# EasyEDA Pro project ProPrj_恒流源_2026-07-14.epro, schematic Schematic1
Assembly Variant: Basic; Board Name: Board1; Create Date: 2026-04-07; Page Name: P1; Project Name: 恒流源; Schematic Name: Schematic1; Simulation Name: P1; Update Date: 2026-04-07; BladeWidth: 10; Company: 嘉立创EDA; Page Size: A4; RegionStart: 1; ShowBorder: 1; TitleBlock: 1; TitleBlockPosition: 3; Version: V1.0; XRegionCount: 6; YRegionCount: 4
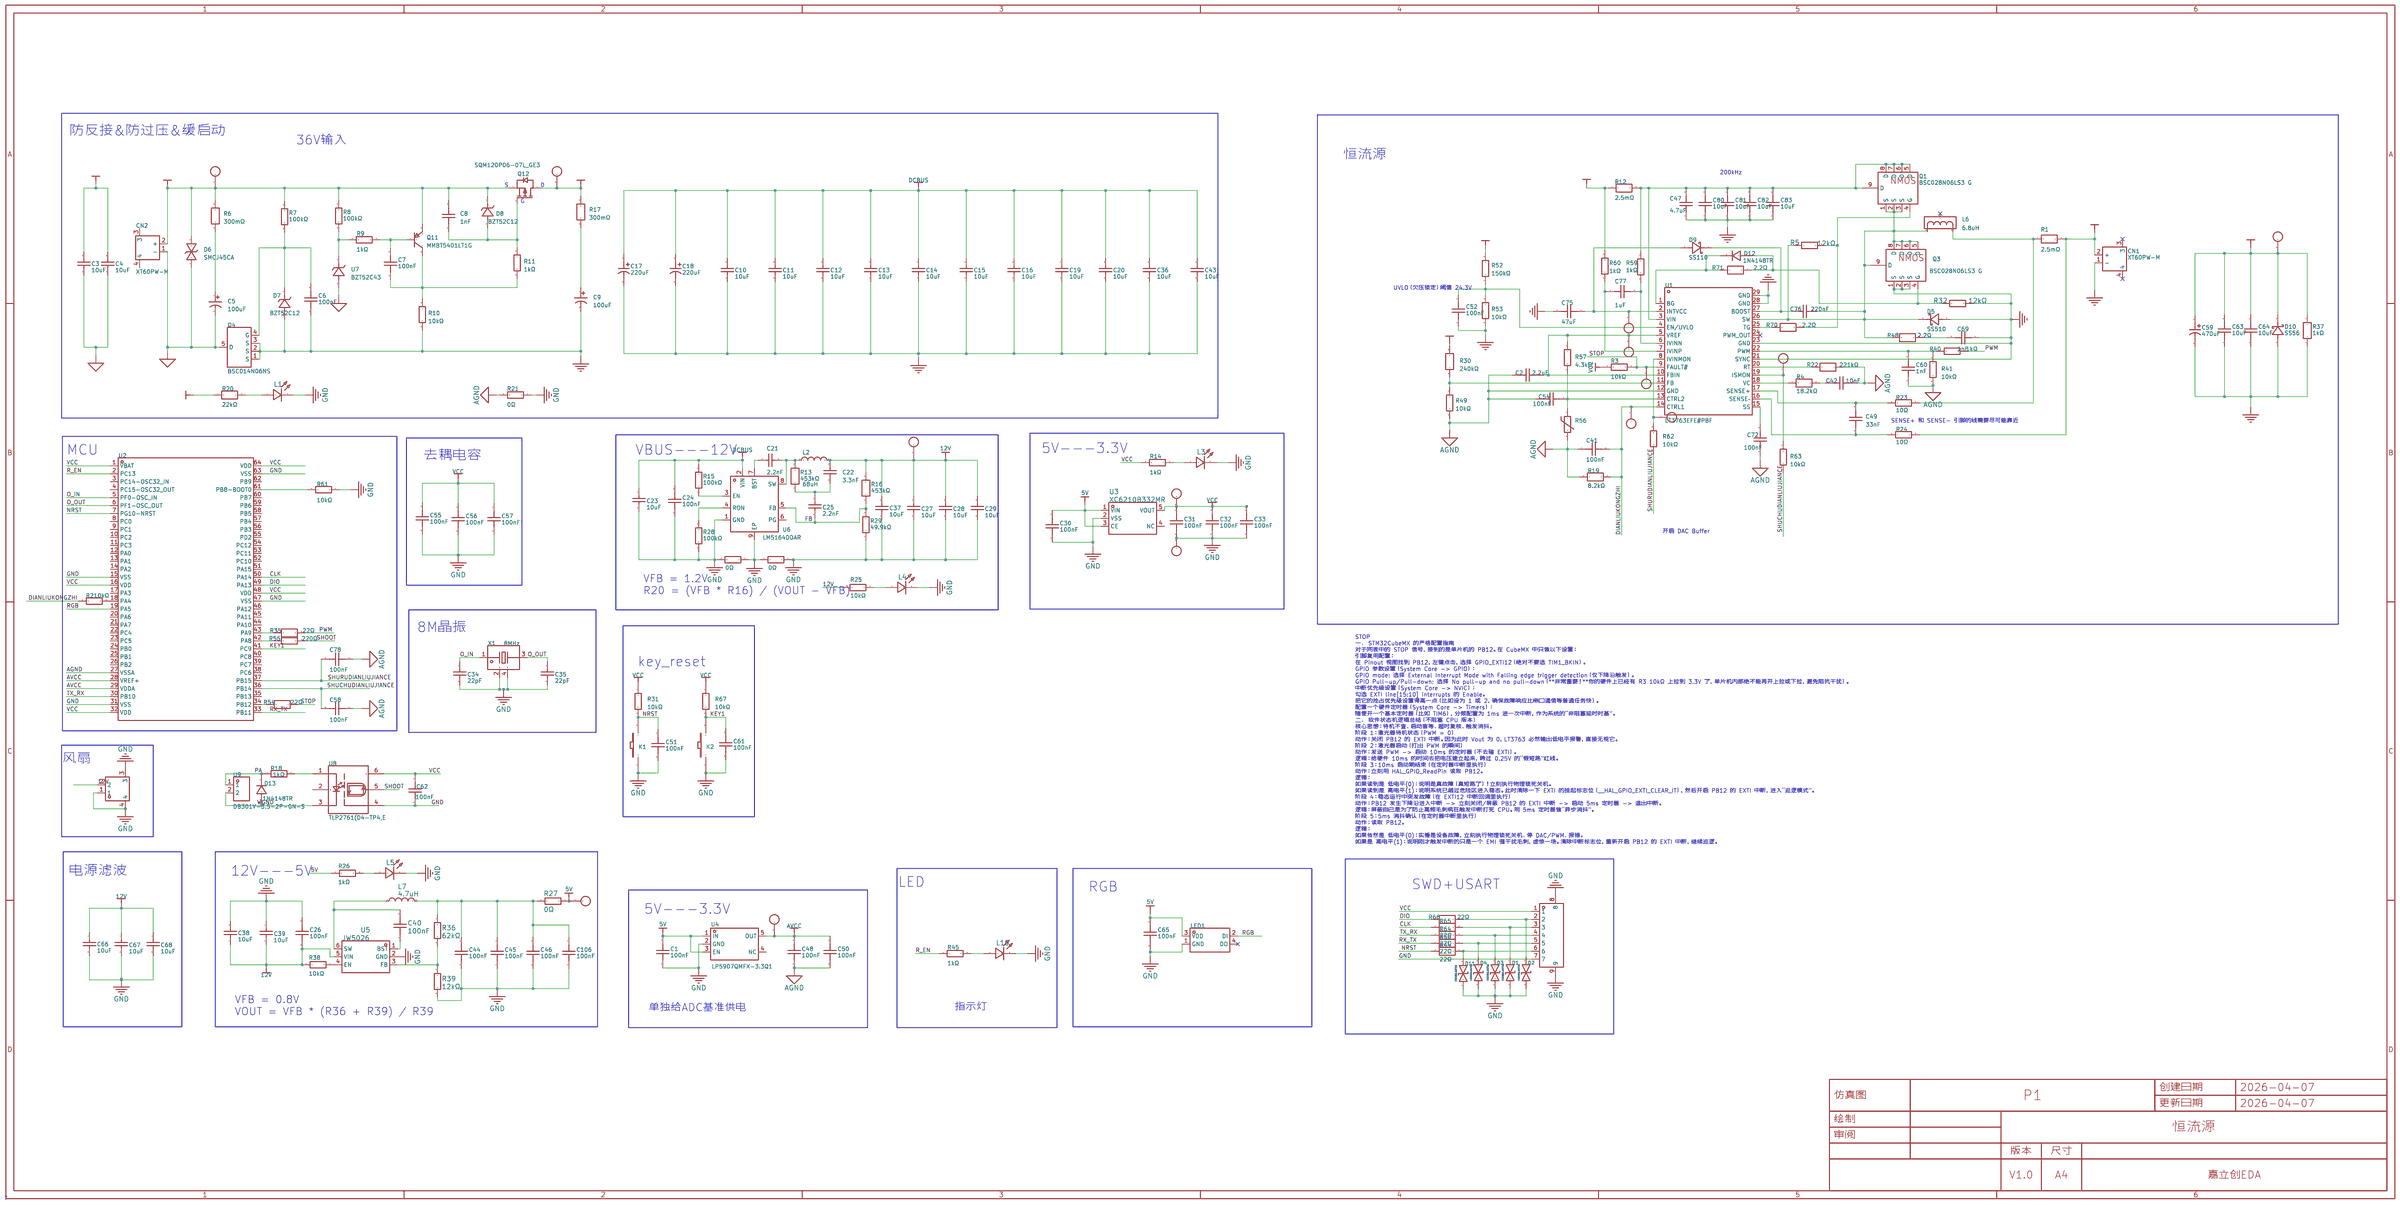
[diagram p0: schematic sheet]

## Parts
C1  100nF  [C0603]
C2  2.2uF  [C0603]
C3  10uF  [C1210]
C4  10uF  [C1210]
C5  100uF  [CAP-SMD_BD10.0-L10.3-W10.3-LS11.0-FD_1]
C6  100nF  [C0603]
C7  100nF  [C0603]
C8  1nF  [C0805]
C9  100uF  [CAP-SMD_BD10.0-L10.3-W10.3-LS11.0-FD_1]
C10  10uF  [C1210]
C11  10uF  [C1210]
C12  10uF  [C1210]
C13  10uF  [C1210]
C14  10uF  [C1210]
C15  10uF  [C1210]
C16  10uF  [C1210]
C17  220uF  [CAP-TH_BD10.0-P5.00-D0.6-FD_2]
C18  220uF  [CAP-TH_BD10.0-P5.00-D0.6-FD_2]
C19  10uF  [C1210]
C20  10uF  [C1210]
C21  2.2nF  [C0805]
C22  3.3nF  [C0603]
C23  10uF  [C1210]
C24  100nF  [C0603]
C25  2.2nF  [C0805]
C26  100nF  [C0603]
C27  10uF  [C0805]
C28  10uF  [C0805]
C29  10uF  [C1210]
C30  100nF  [C0603]
C31  100nF  [C0603]
C32  100nF  [C0603]
C33  100nF  [C0603]
C34  22pF  [C0603]
C35  22pF  [C0603]
C36  10uF  [C1210]
C37  10uF  [C0805]
C38  10uF  [C0805]
C39  10uF  [C0805]
C40  100nF  [C0603]
C41  100nF  [C0603]
C42  10nF  [C0603]
C43  10uF  [C1210]
C44  100nF  [C0603]
C45  100nF  [C0603]
C46  100nF  [C0603]
C47  4.7uF  [C1210]
C48  100nF  [C0603]
C49  33nF  [C1206]
C50  100nF  [C0603]
C51  100nF  [C0603]
C52  100nF  [C0603]
C54  100nF  [C0603]
C55  100nF  [C0603]
C56  100nF  [C0603]
C57  100nF  [C0603]
C58  100nF  [C0603]
C59  470uF  [CAP-TH_BD10.0-P5.00-D0.6-FD-A]
C60  1nF  [C0805]
C61  100nF  [C0603]
C62  100nF  [C0603]
C63  10uF  [C1210]
C64  10uF  [C1210]
C65  100nF  [C0603]
C66  10uF  [C0805]
C67  10uF  [C0805]
C68  10uF  [C0805]
C69  1nF  [C1210]
C72  100nF  [C0603]
C75  47uF  [C1210]
C76  220nF  [C0603]
C77  1uF  [C0805]
C78  100nF  [C0603]
C80  10uF  [C1210]
C81  10uF  [C1210]
C82  10uF  [C1210]
C83  10uF  [C1210]
C106  100nF  [C0603]
CN1  XT60PW-M  [CONN-TH_XT60PW-M]
CN2  XT60PW-M  [CONN-TH_XT60PW-M]
CN3  5012  [TESTPOINT-TH_BD2.0_C9900010656]  (no BOM)
CN4  5012  [TESTPOINT-TH_BD2.0_C9900010656]  (no BOM)
CN5  5012  [TESTPOINT-TH_BD2.0_C9900010656]  (no BOM)
CN6  5012  [TESTPOINT-TH_BD2.0_C9900010656]  (no BOM)
CN7  5012  [TESTPOINT-TH_BD2.0_C9900010656]  (no BOM)
CN8  5012  [TESTPOINT-TH_BD2.0_C9900010656]  (no BOM)
CN9  WAFER-GH1.25-7PWB  [CONN-SMD_7P-P1.25_FWF12514-S07B24W5M]
CN10  2.54-2A-LT  [CONN-SMD_2P-P2.54_XH2.54-2AB]
CN11  5012  [TESTPOINT-TH_BD2.0_C9900010656]  (no BOM)
CN12  5012  [TESTPOINT-TH_BD2.0_C9900010656]  (no BOM)
CN13  5012  [TESTPOINT-TH_BD2.0_C9900010656]  (no BOM)
CN14  5012  [TESTPOINT-TH_BD2.0_C9900010656]  (no BOM)
CN15  5012  [TESTPOINT-TH_BD2.0_C9900010656]  (no BOM)
CN16  5012  [TESTPOINT-TH_BD2.0_C9900010656]  (no BOM)
CN17  5012  [TESTPOINT-TH_BD2.0_C9900010656]  (no BOM)
CN18  5012  [TESTPOINT-TH_BD2.0_C9900010656]  (no BOM)
D1  ESD9B5.0ST5G  [SOD-923_L0.8-W0.6-LS1.0-BI]
D2  ESD9B5.0ST5G  [SOD-923_L0.8-W0.6-LS1.0-BI]
D3  ESD9B5.0ST5G  [SOD-923_L0.8-W0.6-LS1.0-BI]
D4  ESD9B5.0ST5G  [SOD-923_L0.8-W0.6-LS1.0-BI]
D5  SS510  [SMA_L4.3-W2.6-LS5.0-RD]
D6  SMCJ45CA  [SMC_L6.9-W5.9-LS7.9-BI]
D7  BZT52C12  [SOD-123_L2.7-W1.6-LS3.7-RD]
D8  BZT52C12  [SOD-123_L2.7-W1.6-LS3.7-RD]
D9  SS110  [SMA_L4.3-W2.6-LS5.0-RD]
D10  SS56  [SMA_L4.3-W2.6-LS5.0-RD]
D11  ESD9B5.0ST5G  [SOD-923_L0.8-W0.6-LS1.0-BI]
D12  1N4148TR  [DO-35_BD2.0-L4.2-P8.20-D0.5-RD]
D13  1N4148TR  [DO-35_BD2.0-L4.2-P8.20-D0.5-RD]
K1  TS-KG02S  [SW-SMD_4P-L6.0-W6.0-P4.50-LS8.5]
K2  TS-KG02S  [SW-SMD_4P-L6.0-W6.0-P4.50-LS8.5]
L1  NCD0603R1  [LED0603-RD_RED]
L2  68uH  [IND-SMD_L7.2-W6.6_GPSR07X0]
L3  NCD0603R1  [LED0603-RD_RED]
L4  NCD0603R1  [LED0603-RD_RED]
L5  NCD0603R1  [LED0603-RD_RED]
L6  6.8uH  [IND-SMD_3P-L28.0-W27.0]
L7  4.7uH  [IND-SMD_L2.5-W2.0_SWPA252012S]
L10  NCD0603G1  [LED0603-RD_1]
LED1  XL-3528RGBW-2812B  [LED-SMD_4P-L3.5-W2.8-BR-1]
Q1  BSC028N06LS3 G  [PG-TDSON-8_L5.9-W5.2-P1.27-LS6.2-BL-EP]
Q3  BSC028N06LS3 G  [PG-TDSON-8_L5.9-W5.2-P1.27-LS6.2-BL-EP]
Q4  BSC014N06NS  [POWERVDFN-8_L6.2-W5.2-P1.27-LS6.0-BL]
Q11  MMBT5401LT1G  [SOT-23-3_L2.9-W1.3-P1.90-LS2.4-BR]
Q12  SQM120P06-07L_GE3  [TO-263-2_L10.1-W9.1-P5.08-LS15.2-TL-1]
R1  2.5mΩ  [R2512]
R2  10kΩ  [R0805]
R3  10kΩ  [R0805]
R4  18.2kΩ  [R0603]
R5  12kΩ  [R0603]
R6  300mΩ  [R2512]
R7  100kΩ  [R0805]
R8  100kΩ  [R0805]
R9  1kΩ  [R0805]
R10  10kΩ  [R0805]
R11  1kΩ  [R0805]
R12  2.5mΩ  [R2512]
R13  453kΩ  [R0603]
R14  1kΩ  [R0805]
R15  100kΩ  [R0805]
R16  453kΩ  [R0603]
R17  300mΩ  [R2512]
R18  1kΩ  [R0805]
R19  8.2kΩ  [R0805]
R20  22kΩ  [R0603]
R21  0Ω  [R0603]
R22  221kΩ  [R0805]
R23  10Ω  [R0805_NEW]
R24  10Ω  [R0805_NEW]
R25  10kΩ  [R0805]
R26  1kΩ  [R0805]
R27  0Ω  [R0603]
R28  100kΩ  [R0805]
R29  49.9kΩ  [R0603]
R30  240kΩ  [R0603]
R31  10kΩ  [R0805]
R32  12kΩ  [R0603]
R33  0Ω  [R0603]
R34  0Ω  [R0603]
R35  22Ω  [R0603]
R36  62kΩ  [R0805]
R37  1kΩ  [R2512]
R38  10kΩ  [R0805]
R39  12kΩ  [R0603]
R40  1kΩ  [R0805]
R41  10kΩ  [R0805]
R44  22Ω  [R0603]
R45  1kΩ  [R0805]
R48  2.2Ω  [R2010]
R49  10kΩ  [R0805]
R50  22Ω  [R0603]
R52  150kΩ  [R0805]
R53  10kΩ  [R0805]
R54  22Ω  [R0603]
R55  220Ω  [R0603]
R56  HNTC0603-104F3950FB  [R0603]
R57  4.3kΩ  [R0603]
R59  1kΩ  [R0805]
R60  1kΩ  [R0805]
R61  10kΩ  [R0805]
R62  10kΩ  [R0805]
R63  10kΩ  [R0805]
R64  22Ω  [R0603]
R65  22Ω  [R0603]
R66  22Ω  [R0603]
R67  10kΩ  [R0805]
R70  2.2Ω  [R2010]
R71  2.2Ω  [R2010]
U1  LT3763EFE#PBF  [TSSOP-28_L9.7-W4.4-P0.65-LS6.4-BL-EP-1]
U2  STM32G431RBT6  [LQFP-64_L10.0-W10.0-P0.50-LS12.0-BL]
U3  XC6210B332MR  [TSOT-23-5_L2.9-W1.6-P0.95-LS2.8-BR]
U4  LP5907QMFX-3.3Q1  [SOT-23-5_L3.0-W1.7-P0.95-LS2.8-BR]
U5  JW5026  [SOT-23-6_L2.9-W1.6-P0.95-LS2.8-BR]
U6  LM5164DDAR  [SO-8_L4.9-W3.9-P1.27-LS6.0-BL-EP]
U7  BZT52C43  [SOD-123_L2.7-W1.6-LS3.7-RD]
U8  TLP2761(D4-TP4,E  [SOP-6_L7.5-W3.8-P1.27-LS11.1-BL]
U9  DB301V-3.5-2P-GN-S  [CONN-TH_DB301V-3.5-2P-GN]
X1  8MHz  [CRYSTAL-SMD_4P-L3.2-W2.5-BL]

## Library data of the parts
C1 C6 C7 C24 C26 C30-C33 C40 C41 C44-C46 C48 C50-C52 C54-C58 C61 C62 C65 C72 C78 C106 = CC0603KRX7R9BB104: 容值:100nF;精度:±10%;额定电压:50V;温度系数:X7R;; LCSC Part Name: 100nF ±10% 50V; Supplier Part: C14663; Manufacturer: YAGEO(国巨); Supplier Footprint: 0603; JLCPCB Part Class: Basic Part; Datasheet: https://item.szlcsc.com/datasheet/CC0603KRX7R9BB104/15331.html; Supplier: LCSC; Tolerance: ±10%; Voltage Rated: 50V; Temperature Coefficient: X7R; Voltage Rating: 50V
C2 = CL10A225KA8NNNC: 容值:2.2uF;精度:±10%;额定电压:25V;温度系数:X5R;; LCSC Part Name: 2.2uF ±10% 25V; Supplier Part: C57895; Manufacturer: SAMSUNG(三星); Supplier Footprint: 0603; JLCPCB Part Class: Extended Part; Datasheet: https://item.szlcsc.com/datasheet/CL10A225KA8NNNC/58932.html; Supplier: LCSC; Tolerance: ±10%; Voltage Rating: 25V; Temperature Coefficient: X5R
C3 C4 C10-C16 C19 C20 C23 C29 C36 C43 = GRM32ER71H106KA12L: 容值:10uF;精度:±10%;额定电压:50V;温度系数:X7R;; LCSC Part Name: 10uF ±10% 50V; Supplier Part: C77102; Manufacturer: muRata(村田); Supplier Footprint: 1210; JLCPCB Part Class: Extended Part; Datasheet: https://item.szlcsc.com/datasheet/GRM32ER71H106KA12L/78229.html; Supplier: LCSC; Tolerance: ±10%; Voltage Rating: 50V; Temperature Coefficient: X7R
C5 C9 = RVT63V100M10X10: 容值:100uF;精度:±20%;额定电压:63V;纹波电流:200mA@120Hz;等效串联电阻(ESR):-;; LCSC Part Name: 100uF ±20% 63V; Supplier Part: C51953411; Manufacturer: JIERR(捷而瑞); Supplier Footprint: SMD,D10xL10.5mm; JLCPCB Part Class: Extended Part; Datasheet: https://item.szlcsc.com/datasheet/RVT63V100M10X10/54681536.html; Supplier: LCSC; Tolerance: ±20%; Voltage Rating: 63V; Ripple Current: 200mA@120Hz; Diameter: 10mm; Height - Seated (Max): 10.5mm; Lifetime: 2000hrs@105℃; Operating Temperature: -40℃~+105℃
C8 C60 = CC0805KRX7R9BB102: 容值:1nF;精度:±10%;额定电压:50V;温度系数:X7R;; LCSC Part Name: 1nF ±10% 50V; Supplier Part: C94121; Manufacturer: YAGEO(国巨); Supplier Footprint: 0805; JLCPCB Part Class: Extended Part; Datasheet: https://item.szlcsc.com/datasheet/CC0805KRX7R9BB102/95319.html; Supplier: LCSC; Tolerance: ±10%; Voltage Rating: 50V; Temperature Coefficient: X7R
C17 C18 = PA63V220M10x15: 容值:220uF;精度:±20%;额定电压:63V;纹波电流:3.1A@100kHz;等效串联电阻(ESR):18mΩ@100kHz;类型:聚合物;; LCSC Part Name: 220uF ±20% 63V; Supplier Part: C46550454; Manufacturer: JIERR(捷而瑞); Supplier Footprint: 插件,D10xL15mm; JLCPCB Part Class: Extended Part; Datasheet: https://item.szlcsc.com/datasheet/PA63V220M10x15/48680148.html; Supplier: LCSC; Tolerance: ±20%; Voltage Rating: 63V; Ripple Current: 3.1A@100kHz; Equivalent Series Resistance(ESR): 18mΩ@100kHz; Type: 聚合物; Pin Spacing: 5mm; Diameter: 10mm; Height - Seated (Max): 15mm; Lifetime: 2000hrs@105℃; Operating Temperature: -55℃~+105℃
C21 C25 = CL21C222JBFNNNE: 容值:2.2nF;精度:±5%;额定电压:50V;温度系数:C0G;; LCSC Part Name: 2.2nF ±5% 50V; Supplier Part: C28260; Manufacturer: SAMSUNG(三星); Supplier Footprint: 0805; JLCPCB Part Class: Basic Part; Datasheet: https://item.szlcsc.com/datasheet/CL21C222JBFNNNE/29010.html; Supplier: LCSC; Tolerance: ±5%; Voltage Rating: 50V; Temperature Coefficient: C0G
C22 = CL10B332KB8NNNC: 容值:3.3nF;精度:±10%;额定电压:50V;温度系数:X7R;; LCSC Part Name: 3.3nF ±10% 50V; Supplier Part: C1613; Manufacturer: SAMSUNG(三星); Supplier Footprint: 0603; JLCPCB Part Class: Basic Part; Datasheet: https://item.szlcsc.com/datasheet/CL10B332KB8NNNC/1965.html; Supplier: LCSC; Tolerance: ±10%; Voltage Rated: 50V; Temperature Coefficient: X7R; Voltage Rating: 50V
C27 C28 C37-C39 C66-C68 = CGA0805X5R106K500MT: 容值:10uF;精度:±10%;额定电压:50V;温度系数:X5R;; LCSC Part Name: 10uF ±10% 50V; Supplier Part: C6119889; Manufacturer: HRE(芯声); Supplier Footprint: 0805; JLCPCB Part Class: Extended Part; Datasheet: https://item.szlcsc.com/datasheet/CGA0805X5R106K500MT/7062595.html; Supplier: LCSC; Tolerance: ±10%; Voltage Rating: 50V; Temperature Coefficient: X5R
C34 C35 = CL10C220JB8NNNC: 容值:22pF;精度:±5%;额定电压:50V;温度系数:C0G;; LCSC Part Name: 22pF ±5% 50V; Supplier Part: C1653; Manufacturer: SAMSUNG(三星); Supplier Footprint: 0603; JLCPCB Part Class: Basic Part; Datasheet: https://item.szlcsc.com/datasheet/CL10C220JB8NNNC/2005.html; Supplier: LCSC; Tolerance: ±5%; Voltage Rating: 50V; Temperature Coefficient: C0G
C42 = CGA3E1C0G2A103JT0Y0E: 容值:10nF;精度:±5%;额定电压:100V;温度系数:C0G;; LCSC Part Name: 10nF ±5% 100V; Supplier Part: C432938; Manufacturer: TDK; Supplier Footprint: 0603; JLCPCB Part Class: Extended Part; Datasheet: https://item.szlcsc.com/datasheet/CGA3E1C0G2A103JT0Y0E/429890.html; Supplier: LCSC; Tolerance: ±5%; Voltage Rating: 100V; Temperature Coefficient: C0G
C47 = HHV1210R7475K101NSVK: 容值:4.7uF;精度:±10%;额定电压:100V;温度系数:X7R;; LCSC Part Name: 4.7uF ±10% 100V; Supplier Part: C33546021; Manufacturer: Chinocera(华瓷); Supplier Footprint: 1210; JLCPCB Part Class: Extended Part; Datasheet: https://item.szlcsc.com/datasheet/HHV1210R7475K101NSVK/35278499.html; Supplier: LCSC; Tolerance: ±10%; Voltage Rating: 100V; Temperature Coefficient: X7R
C49 = GRM3195C2A333JA01D: 容值:33nF;精度:±5%;额定电压:100V;温度系数:C0G;; LCSC Part Name: 33nF ±5% 100V; Supplier Part: C5200606; Manufacturer: muRata(村田); Supplier Footprint: 1206; JLCPCB Part Class: Extended Part; Datasheet: https://item.szlcsc.com/datasheet/GRM3195C2A333JA01D/5888017.html; Supplier: LCSC; Tolerance: ±5%; Voltage Rating: 100V; Temperature Coefficient: C0G
C59 = PA63V470M10X17: 容值:470uF;精度:±20%;额定电压:63V;纹波电流:4.1A@100kHz;等效串联电阻(ESR):18mΩ@100kHz;类型:聚合物;; LCSC Part Name: 470uF ±20% 63V; Supplier Part: C49232909; Manufacturer: JIERR(捷而瑞); Supplier Footprint: 插件,D10xL17mm; JLCPCB Part Class: Extended Part; Datasheet: https://item.szlcsc.com/datasheet/PA63V470M10X17/51647988.html; Supplier: LCSC; Tolerance: ±20%; Voltage Rating: 63V; Ripple Current: 4.1A@100kHz; Equivalent Series Resistance(ESR): 18mΩ@100kHz; Type: 聚合物; Pin Spacing: 5mm; Diameter: 10mm; Height - Seated (Max): 17mm; Lifetime: 2000hrs@105℃; Operating Temperature: -55℃~+105℃
C63 C64 C80-C83 = FS32X106K101EGG: 容值:10uF;精度:±10%;额定电压:100V;温度系数:X7R;; LCSC Part Name: 10uF ±10% 100V; Supplier Part: C5156756; Manufacturer: PSA(信昌电陶); Supplier Footprint: 1210; JLCPCB Part Class: Extended Part; Datasheet: https://item.szlcsc.com/datasheet/FS32X106K101EGG/5791227.html; Supplier: LCSC; Tolerance: ±10%; Voltage Rating: 100V; Temperature Coefficient: X7R
C69 = FV32N102J202EFG: 容值:1nF;精度:±5%;额定电压:2kV;温度系数:C0G;; LCSC Part Name: 1nF ±5% 2kV; Supplier Part: C692314; Manufacturer: PSA(信昌电陶); Supplier Footprint: 1210; JLCPCB Part Class: Extended Part; Datasheet: https://item.szlcsc.com/datasheet/FV32N102J202EFG/724197.html; Supplier: LCSC; Tolerance: ±5%; Voltage Rating: 2kV; Temperature Coefficient: C0G
C75 = HGC1210R5476M250NSVK: 容值:47uF;精度:±20%;额定电压:25V;温度系数:X5R;; LCSC Part Name: 47uF ±20% 25V; Supplier Part: C7432791; Manufacturer: Chinocera(华瓷); Supplier Footprint: 1210; JLCPCB Part Class: Extended Part; Datasheet: https://item.szlcsc.com/datasheet/HGC1210R5476M250NSVK/8438273.html; Supplier: LCSC; Tolerance: ±20%; Voltage Rating: 25V; Temperature Coefficient: X5R
C76 = CL10B224KA8NNNC: 容值:220nF;精度:±10%;额定电压:25V;温度系数:X7R;; LCSC Part Name: 220nF ±10% 25V; Supplier Part: C21120; Manufacturer: SAMSUNG(三星); Supplier Footprint: 0603; JLCPCB Part Class: Basic Part; Datasheet: https://item.szlcsc.com/datasheet/CL10B224KA8NNNC/21832.html; Supplier: LCSC; Tolerance: ±10%; Voltage Rating: 25V; Temperature Coefficient: X7R
C77 = CC0805KKX7R0BB105: 容值:1uF;精度:±10%;额定电压:100V;温度系数:X7R;; LCSC Part Name: 1uF ±10% 100V; Supplier Part: C5370002; Manufacturer: YAGEO(国巨); Supplier Footprint: 0805; JLCPCB Part Class: Extended Part; Datasheet: https://item.szlcsc.com/datasheet/CC0805KKX7R0BB105/6213252.html; Supplier: LCSC; Tolerance: ±10%; Voltage Rating: 100V; Temperature Coefficient: X7R
CN1 CN2 = XT60PW-M: 模型锂电连接器; LCSC Part Name: AMASS(艾迈斯)航模插头xt60连接器150公母对接pw锂电池公头 接PCB板卧式 黄色 公头XT60PW-M.G.Y; Supplier Part: C98732; Manufacturer: AMASS(艾迈斯); JLCPCB Part Class: Extended Part; Datasheet: https://item.szlcsc.com/datasheet/XT60PW-M/99942.html; Supplier: LCSC; colour: 黄色; Connector type: 卧式插头; interface form: 公头
CN3-CN8 CN11-CN18 = 5012: LCSC Part Name: 测试点; Supplier Part: C2906766; Manufacturer: Keystone; JLCPCB Part Class: ExtendedPart; Datasheet: https://atta.szlcsc.com/upload/public/pdf/source/20211102/12102DF701EA335825673F0350517149.pdf; Supplier: LCSC; Check: true
CN9 = WAFER-GH1.25-7PWB: 插针结构:1x7P;间距:1.25mm;安装方式:卧贴;参考系列:GH;总PIN数:7P;排数:1;每排PIN数:7;行距:-;额定电流:1A;触头材质:黄铜;触头镀层:锡;工作温度:-25℃~+85℃;; LCSC Part Name: 1x7P 间距:1.25mm 卧贴 系列:GH; Supplier Part: C3029382; Manufacturer: XUNPU(讯普); Supplier Footprint: SMD,P=1.25mm,卧贴; JLCPCB Part Class: Extended Part; Datasheet: https://item.szlcsc.com/datasheet/WAFER-GH1.25-7PWB/3561394.html; Supplier: LCSC; Pins Structure: 1x7P; Pitch: 1.25mm; Mounting Type: 卧贴; Reference Series: GH; Number of Pins: 7P; Number of Rows: 1; Number of PINs Per Row: 7; Current Rating: 1A; Contact Material: 黄铜; Contact Plating: 锡; Operating Temperature: -25℃~+85℃; Voltage Rating: 125V; Plastic Material: LCP; Supplementary Features: 辅助焊脚; Color: 米色; Z-Height of the Board: 4.35mm; X-Length of Bottom Edge on Board (Spacing Line): 12mm; Y-Width of Bottom Edge on Board: 5mm
CN10 = 2.54-2A-LT: 插针结构:1x2P;间距:2.54mm;安装方式:立贴;参考系列:XH;总PIN数:2P;排数:1;每排PIN数:2;行距:-;额定电流:500mA;触头材质:磷铜;触头镀层:锡;工作温度:-25℃~+85℃;; LCSC Part Name: 1x2P 间距:2.54mm 立贴 系列:XH; Supplier Part: C722695; Manufacturer: CAX(创都); Supplier Footprint: SMD,P=2.54mm; JLCPCB Part Class: Extended Part; Datasheet: https://item.szlcsc.com/datasheet/2.54-2A-LT/766902.html; Supplier: LCSC; Pins Structure: 1x2P; Pitch: 2.54mm; Mounting Type: 立贴; Reference Series: XH; Number of Pins: 2P; Number of Rows: 1; Number of PINs Per Row: 2; Current Rating: 500mA; Contact Material: 磷铜; Contact Plating: 锡; Operating Temperature: -25℃~+85℃; Voltage Rating: 50V; Plastic Material: LCP; Color: 米色; Z-Height of the Board: 7.9mm; Y-Width of Bottom Edge on Board: 6mm
D1-D4 D11 = ESD9B5.0ST5G: 极性:双向;反向截止电压(Vrwm):5V;钳位电压:15V;峰值脉冲功率(Ppp):-;击穿电压:7.8V;; LCSC Part Name: 双向ESD; Supplier Part: C111566; Manufacturer: onsemi(安森美); Supplier Footprint: SOD-923; JLCPCB Part Class: Extended Part; Datasheet: https://item.szlcsc.com/datasheet/ESD9B5.0ST5G/112793.html; Supplier: LCSC; Polarity: 双向; Reverse Stand-Off Voltage (Vrwm): 5V; Clamping Voltage: 15V; Voltage - Breakdown: 7.8V; Reverse Leakage Current (Ir): 100nA; Number of Channels: 单路; Operating Temperature: -55℃~+150℃@(Tj); level of protection: IEC 61000-4-2; Type: TVS; Junction Capacitance: 15pF
D5 = SS510_C18199171: 二极管配置:独立式;正向压降(Vf):850mV@5A;直流反向耐压(Vr):100V;整流电流:5A;; LCSC Part Name: 电压:100V 电流:5A; Supplier Part: C18199171; Manufacturer: R+O(宏嘉诚); Supplier Footprint: SMA(DO-214AC); JLCPCB Part Class: Extended Part; Datasheet: https://item.szlcsc.com/datasheet/SS510/19354403.html; Supplier: LCSC; Diode Configuration: 独立式; Voltage - Forward(Vf@If): 850mV@5A; Voltage - DC Reverse(Vr): 100V; Current - Rectified: 5A; Reverse Leakage Current (Ir): 50uA@100V; Operating Junction Temperature Range: -55℃~+150℃; Non-Repetitive Peak Forward Surge Current: 120A
D6 = SMCJ45CA_C41411750: 极性:双向;反向截止电压(Vrwm):45V;钳位电压:72.7V;峰值脉冲电流(Ipp):20.6A;峰值脉冲功率(Ppp):1.5kW;击穿电压:55.3V;; LCSC Part Name: 双向TVS 45V截止 峰值浪涌电流：20.6A; Supplier Part: C41411750; Manufacturer: R+O(宏嘉诚); Supplier Footprint: SMC(DO-214AB); JLCPCB Part Class: Extended Part; Datasheet: https://item.szlcsc.com/datasheet/SMCJ45CA/43223693.html; Supplier: LCSC; Polarity: 双向; Reverse Stand-Off Voltage (Vrwm): 45V; Clamping Voltage: 72.7V; Peak Pulse Current (Ipp): 20.6A; Peak Pulse Power Dissipation (Ppp): 1.5kW; Voltage - Breakdown: 55.3V; Reverse Leakage Current (Ir): 1uA; Number of Channels: 双路; Operating Temperature: -55℃~+150℃; level of protection: IEC 61000-4-2; Type: TVS
D7 D8 = BZT52C12_C19077410: 二极管配置:独立式;稳压值(标称值):12V;稳压值(范围):11.4V~12.6V;耗散功率(Pd):350mW;; LCSC Part Name: 表面贴装齐纳二极管; Supplier Part: C19077410; Manufacturer: R+O(宏嘉诚); Supplier Footprint: SOD-123; JLCPCB Part Class: Extended Part; Datasheet: https://item.szlcsc.com/datasheet/BZT52C12/20275495.html; Supplier: LCSC; Diode Configuration: 独立式; Zener Voltage(Nom): 12V; Reverse Leakage Current (Ir): 100nA@8.0V; Zener Voltage(Range): 11.4V~12.6V; Pd - Power Dissipation: 350mW; Impedance(Zzt): 25Ω; Impedance(Zzk): 150Ω; Operating Junction Temperature Range: -55℃~+150℃
D9 = SS110_C18199178: 二极管配置:独立式;正向压降(Vf):850mV@1A;直流反向耐压(Vr):100V;整流电流:1A;; LCSC Part Name: 电压:100V 电流:1A; Supplier Part: C18199178; Manufacturer: R+O(宏嘉诚); Supplier Footprint: SMA(DO-214AC); JLCPCB Part Class: Extended Part; Datasheet: https://item.szlcsc.com/datasheet/SS110/19354410.html; Supplier: LCSC; Diode Configuration: 独立式; Voltage - Forward(Vf@If): 850mV@1A; Voltage - DC Reverse(Vr): 100V; Current - Rectified: 1A; Reverse Leakage Current (Ir): 50uA@100V; Operating Junction Temperature Range: -55℃~+150℃; Non-Repetitive Peak Forward Surge Current: 30A
D10 = SS56_C18199169: 二极管配置:独立式;正向压降(Vf):700mV@5.0A;直流反向耐压(Vr):60V;整流电流:5A;; LCSC Part Name: 电压:60V 电流:5A; Supplier Part: C18199169; Manufacturer: R+O(宏嘉诚); Supplier Footprint: SMA(DO-214AC); JLCPCB Part Class: Extended Part; Datasheet: https://item.szlcsc.com/datasheet/SS56/19354401.html; Supplier: LCSC; Diode Configuration: 独立式; Voltage - Forward(Vf@If): 700mV@5.0A; Voltage - DC Reverse(Vr): 60V; Current - Rectified: 5A; Reverse Leakage Current (Ir): 200uA@60V; Operating Junction Temperature Range: -55℃~+125℃; Non-Repetitive Peak Forward Surge Current: 120A
D12 D13 = 1N4148TR_C84410: 二极管配置:1个独立式;整流电流:200mA;直流反向耐压(Vr):100V;正向压降(Vf):1V@10mA;反向恢复时间(Trr):4ns;; LCSC Part Name: 100V 200mA; Supplier Part: C84410; Manufacturer: onsemi(安森美); Supplier Footprint: DO-35; JLCPCB Part Class: Extended Part; Datasheet: https://item.szlcsc.com/datasheet/1N4148TR/85580.html; Supplier: LCSC; Diode Configuration: 1个独立式; Pd - Power Dissipation: 500mW; Current - Rectified: 200mA; Voltage - DC Reverse(Vr): 100V; Voltage - Forward(Vf@If): 1V@10mA; Non-Repetitive Peak Forward Surge Current: 4A; Reverse Leakage Current (Ir): 5uA@75V; Reverse Recovery Time (trr): 4ns; Operating Junction Temperature Range: -55℃~+175℃@(Tj)
K1 K2 = TS-KG02S: 电路结构:单刀单掷;触点电流:50mA;额定电压(DC):12V;安装方式:立贴;绝缘电阻:100MΩ;带灯:-;机械寿命:-;; Supplier: LCSC; Supplier Part: C410366; Manufacturer: HANBO(汉博); JLCPCB Part Class: 扩展库; LCSC Part Name: 6*6*4.3mm 立贴 轻触开关; Supplier Footprint: SMD,6x6mm; Datasheet: https://atta.szlcsc.com/upload/public/pdf/source/20221110/4B16732C66B2A039D9853E84B21A4EEA.pdf; Circuit: 单刀单掷; Actuator Style: 圆形按钮; Switch Length: 6mm; Switch Width: 6mm; Switch Height: 4.3mm; Contact Current: 50mA; Voltage Rating (DC): 12V; Mounting Style: 立贴; Insulation Resistance: 100MΩ; Check: true
L1 L3-L5 = NCD0603R1_C84263: 灯头类型:-;发光颜色:红色;正向压降(Vf):1.6V~2.6V;功率:65mW;正向电流:25mA;波长:615nm~630nm;二极管配置:独立二极管;透镜颜色:-;色温:-;发光强度:220mcd;发光角度:130°;载带方式:-;工作温度:-30℃~+85℃;; LCSC Part Name: 片式发光二极管; Supplier Part: C84263; Manufacturer: 国星光电; Supplier Footprint: 0603; JLCPCB Part Class: Extended Part; Datasheet: https://item.szlcsc.com/datasheet/NCD0603R1/85432.html; Supplier: LCSC; Illumination Color: 红色; Voltage - Forward(Vf): 1.6V~2.6V; Power(Watts): 65mW; Forward Current: 25mA; Wavelength - Dominant: 615nm~630nm; Peak Wavelength: 630nm; Diode Configuration: 独立二极管; Luminous Intensity: 220mcd; Viewing Angle: 130°; Operating Temperature: -30℃~+85℃
L2 = CYA0650-68UH: 电感值:68uH;精度:±20%;额定电流:1.8A;直流电阻(DCR):315mΩ;; LCSC Part Name: 68uH ±20%; Supplier Part: C5189964; Manufacturer: SHOU HAN(首韩); Supplier Footprint: SMD,7.2x6.6mm; JLCPCB Part Class: Extended Part; Datasheet: https://atta.szlcsc.com/upload/public/pdf/source/20221010/1CB48C1FE5E3157A229723F3ED8F3EBC.pdf; Supplier: LCSC; Tolerance: ±20%; Rated Current: 1.8A; DC Resistance (DCR): 315mΩ
L6 = MTP2915-6R8MC: 电感值:6.8uH;精度:±20%;额定电流:30A;饱和电流(Isat):40A;类型:扁平线电感;; LCSC Part Name: 6.8uH ±20% 40A; Supplier Part: C881788; Manufacturer: COILMX(迈翔科技); Supplier Footprint: SMD; JLCPCB Part Class: Extended Part; Datasheet: https://item.szlcsc.com/datasheet/MTP2915-6R8MC/945166.html; Supplier: LCSC; Tolerance: ±20%; Current Rating: 30A; Current - Saturation(Isat): 40A; DC Resistance(DCR): 2mΩ; Type: 扁平线电感
L7 = MPIH252010-4R7M-LF: 电感值:4.7uH;精度:±20%;额定电流:1A;; LCSC Part Name: 4.7uH ±20%; Supplier Part: C490449; Manufacturer: microgate(麦捷科技); Supplier Footprint: 1008; JLCPCB Part Class: Extended Part; Datasheet: https://item.szlcsc.com/datasheet/MPIH252010-4R7M-LF/500954.html; Supplier: LCSC; Tolerance: ±20%; Rated Current: 1A; DC Resistance (DCR): 275mΩ; Current Rating: 1A; DC Resistance(DCR): 275mΩ
L10 = NCD0603G1: 灯头类型:-;发光颜色:翠绿色;正向压降(Vf):2.6V~3.6V;功率:72mW;正向电流:20mA;波长:515nm~530nm;二极管配置:独立二极管;透镜颜色:-;色温:-;发光强度:900mcd;发光角度:130°;载带方式:-;工作温度:-30℃~+85℃;; LCSC Part Name: 片式发光二极管; Supplier Part: C84267; Manufacturer: 国星光电; Supplier Footprint: 0603; JLCPCB Part Class: Extended Part; Datasheet: https://item.szlcsc.com/datasheet/NCD0603G1/85436.html; Supplier: LCSC; Illumination Color: 翠绿色; Voltage - Forward(Vf): 2.6V~3.6V; Power(Watts): 72mW; Forward Current: 20mA; Wavelength - Dominant: 515nm~530nm; Peak Wavelength: 520nm; Diode Configuration: 独立二极管; Luminous Intensity: 900mcd; Viewing Angle: 130°; Operating Temperature: -30℃~+85℃
LED1 = XL-3528RGBW-WS2812B: 3528幻彩雾状   内置驱动IC    WS2812B; Supplier Part: C2890364; Manufacturer: XINGLIGHT(成兴光); Supplier Footprint: SMD3528-4P; JLCPCB Part Class: Extended Part; Datasheet: https://item.szlcsc.com/datasheet/XL-3528RGBW-2812B/3114290.html; Supplier: LCSC; Emitted Color: RGB三色; Dominant Wavelength: 618nm~623nm；520nm~525nm；467nm~472nm; Peak Wavelength: R:625nm；B:470nm；G:525nm; Forward Current: 20mA; Power Dissipation: 50mW；50mW；45mW; Viewing Angle: 120°; Mounting Sytle: 正贴; Operating Temperature: -20℃~+85℃; Wavelength: 520nm~525nm；618nm~623nm；467nm~472nm; Luminous Intensity: G:600mcd~800mcd；R:200mcd~300mcd；B:100mcd~200mcd; Fixed-Frequency Pwm Mode: 1.5kHz; Data Transmission Rate: 800Kbit/s; Voltage - Supply: 3.5V~5.5V; Quiescent Current: 0.5mA; ESD Withstand Voltage: 2000V; Installation method: 正贴; Length: 3.5mm; Width: 1.85mm; Height: 2.8mm
Q1 Q3 = BSC028N06LS3 G: 数量:1个N沟道;漏源电压(Vdss):60V;连续漏极电流(Id):100A;导通电阻(RDS(on)):2.8mΩ@10V,50A;耗散功率(Pd):139W;阈值电压(Vgs(th)):2.2V;; LCSC Part Name: 1个N沟道 耐压:60V 电流:100A; Supplier Part: C534316; Manufacturer: Infineon(英飞凌); Supplier Footprint: TDSON-8(5x6); JLCPCB Part Class: Extended Part; Datasheet: https://item.szlcsc.com/datasheet/BSC028N06LS3%2520G/554700.html; Supplier: LCSC; Number: 1个N沟道; Drain to Source Voltage: 60V; Current - Continuous Drain(Id): 100A; RDS(on): 2.8mΩ@10V,50A; Pd - Power Dissipation: 139W; Gate Threshold Voltage (Vgs(th)): 2.2V; Input Capacitance(Ciss): 13nF@30V; Reverse Transfer Capacitance (Crss@Vds): 2.3nF@30V; Operating Temperature: -55℃~+150℃
Q4 = BSC014N06NS: 数量:1个N沟道;漏源电压(Vdss):60V;连续漏极电流(Id):100A;导通电阻(RDS(on)):1.45mΩ@10V;耗散功率(Pd):156W;阈值电压(Vgs(th)):3.3V;; LCSC Part Name: 1个N沟道 耐压:60V 电流:100A; Supplier Part: C113391; Manufacturer: Infineon(英飞凌); Supplier Footprint: TDSON-8-FL; JLCPCB Part Class: Extended Part; Datasheet: https://item.szlcsc.com/datasheet/BSC014N06NS/114626.html; Supplier: LCSC; Number: 1个N沟道; Drain to Source Voltage: 60V; Current - Continuous Drain(Id): 100A; RDS(on): 1.45mΩ@10V; Pd - Power Dissipation: 156W; Gate Threshold Voltage (Vgs(th)): 3.3V; Gate Charge(Qg): 104nC@10V; Input Capacitance(Ciss): 8.125nF; Reverse Transfer Capacitance (Crss@Vds): 118pF; Operating Temperature: -55℃~+150℃; Type: N沟道; Output Capacitance(Coss): 1.875nF
Q11 = MMBT5401LT1G: 晶体管类型:PNP;集电极电流(Ic):500mA;集射极击穿电压(Vceo):150V;耗散功率(Pd):300mW;直流电流增益(hFE):60@10mA,5V;; LCSC Part Name: PNP 电流:500mA 电压:150V; Supplier Part: C21488; Manufacturer: onsemi(安森美); Supplier Footprint: SOT-23; JLCPCB Part Class: Extended Part; Datasheet: https://item.szlcsc.com/datasheet/MMBT5401LT1G/22205.html; Supplier: LCSC; type: PNP; Current - Collector(Ic): 500mA; Collector - Emitter Voltage VCEO: 150V; Pd - Power Dissipation: 300mW; DC Current Gain: 60@10mA,5V; Transition frequency(fT): 300MHz; Current - Collector Cutoff: 50nA; Vce Saturation(VCE(sat)): 200mV@10mA,5mA; Operating Temperature: -55℃~+150℃; Emitter-Base Voltage(Vebo): 5V
Q12 = SQM120P06-07L_GE3: 数量:1个P沟道;漏源电压(Vdss):60V;连续漏极电流(Id):120A;导通电阻(RDS(on)):8.8mΩ@4.5V;耗散功率(Pd):375W;阈值电压(Vgs(th)):2.5V@250uA;; LCSC Part Name: 1个P沟道 耐压:60V 电流:120A; Supplier Part: C222447; Manufacturer: VISHAY(威世); Supplier Footprint: TO-263; JLCPCB Part Class: Extended Part; Datasheet: https://item.szlcsc.com/datasheet/SQM120P06-07L_GE3/222742.html; Supplier: LCSC; Number: 1个P沟道; Drain to Source Voltage: 60V; Current - Continuous Drain(Id): 120A; RDS(on): 8.8mΩ@4.5V; Pd - Power Dissipation: 375W; Gate Threshold Voltage (Vgs(th)): 2.5V@250uA; Gate Charge(Qg): 270nC@10V; Input Capacitance(Ciss): 14.28nF; Reverse Transfer Capacitance (Crss@Vds): 1.295nF; Operating Temperature: -55℃~+175℃; Type: P沟道
R1 R12 = HoCG251232m50D4: 阻值:2.5mΩ;精度:±0.5%;功率:3W;温度系数:±100ppm/℃;安装方式:贴片;; Supplier Part: C48868281; Manufacturer: Milliohm(毫欧); Supplier Footprint: 2512; JLCPCB Part Class: Extended Part; Datasheet: https://item.szlcsc.com/datasheet/HoCG251232m50D4/51167498.html; Supplier: LCSC; Tolerance: ±0.5%; Power(Watts): 3W; Temperature Coefficient: ±100ppm/℃; Mounting Type: 贴片
R2 R3 R10 R25 R31 R38 R41 R49 R53 R61-R63 R67 = RT0805BRD0710KL: 电阻类型:薄膜电阻;阻值:10kΩ;精度:±0.1%;功率:125mW;工作电压:150V;温度系数:±25ppm/℃;; LCSC Part Name: 薄膜电阻 10kΩ ±0.1% 125mW; Supplier Part: C110775; Manufacturer: YAGEO(国巨); Supplier Footprint: 0805; JLCPCB Part Class: Extended Part; Datasheet: https://item.szlcsc.com/datasheet/RT0805BRD0710KL/112000.html; Supplier: LCSC; Type: 薄膜电阻; Tolerance: ±0.1%; Power(Watts): 125mW; Voltage-Supply(Max): 150V; Temperature Coefficient: ±25ppm/℃; Operating Temperature: -55℃~+155℃
R4 = FRC0603F1822TS: 电阻类型:厚膜电阻;阻值:18.2kΩ;精度:±1%;功率:100mW;工作电压:75V;温度系数:±100ppm/℃;; LCSC Part Name: 18.2kΩ ±1% 100mW 厚膜电阻; Supplier Part: C2933164; Manufacturer: FOJAN(富捷); Supplier Footprint: 0603; JLCPCB Part Class: Extended Part; Datasheet: https://item.szlcsc.com/datasheet/FRC0603F1822TS/3279266.html; Supplier: LCSC; Type: 厚膜电阻; Tolerance: ±1%; Power(Watts): 100mW; Voltage-Supply(Max): 75V; Temperature Coefficient: ±100ppm/℃; Operating Temperature: -55℃~+155℃
R5 R32 R39 = 0603WAF1202T5E: 电阻类型:厚膜电阻;阻值:12kΩ;精度:±1%;功率:100mW;工作电压:75V;温度系数:±100ppm/℃;; LCSC Part Name: 12kΩ ±1% 100mW 厚膜电阻; Supplier Part: C22790; Manufacturer: UNI-ROYAL(厚声); Supplier Footprint: 0603; JLCPCB Part Class: Basic Part; Datasheet: https://item.szlcsc.com/datasheet/0603WAF1202T5E/23517.html; Supplier: LCSC; Tolerance: ±1%; Power(Watts): 100mW; Overload Voltage (Max): 75V; Temperature Coefficient: ±100ppm/℃; Type: 厚膜电阻; Operating Temperature Range: -55℃~+155℃; Voltage-Supply(Max): 75V; Operating Temperature: -55℃~+155℃
R6 R17 = HoYLR2512-3W-300mR-1%: 电阻类型:采样电阻;阻值:300mΩ;精度:±1%;功率:3W;安装方式:贴片;; LCSC Part Name: 300mΩ ±1% 3W; Supplier Part: C5375492; Manufacturer: Milliohm(毫欧); Supplier Footprint: 2512; JLCPCB Part Class: Extended Part; Datasheet: https://item.szlcsc.com/datasheet/HoYLR2512-3W-300mR-1%2525/6233989.html; Supplier: LCSC; Type: 采样电阻; Tolerance: ±1%; Power(Watts): 3W; Mounting Type: 贴片
R7 R8 R15 R28 = 0805W8F1003T5E: 电阻类型:厚膜电阻;阻值:100kΩ;精度:±1%;功率:125mW;工作电压:150V;温度系数:±100ppm/℃;; LCSC Part Name: 100kΩ ±1% 125mW 厚膜电阻; Supplier Part: C149504; Manufacturer: UNI-ROYAL(厚声); Supplier Footprint: 0805; JLCPCB Part Class: Basic Part; Datasheet: https://item.szlcsc.com/datasheet/0805W8F1003T5E/160838.html; Supplier: LCSC; Type: 厚膜电阻; Tolerance: ±1%; Power(Watts): 125mW; Voltage-Supply(Max): 150V; Temperature Coefficient: ±100ppm/℃; Operating Temperature: -55℃~+155℃
R9 R11 R14 R18 R26 R40 R45 R59 R60 = 0805W8F1001T5E: 电阻类型:厚膜电阻;阻值:1kΩ;精度:±1%;功率:125mW;最大工作电压:150V;温度系数:±100ppm/℃;; LCSC Part Name: 1kΩ ±1% 125mW 厚膜电阻; Supplier Part: C17513; Manufacturer: UNI-ROYAL(厚声); Supplier Footprint: 0805; JLCPCB Part Class: Basic Part; Datasheet: https://atta.szlcsc.com/upload/public/pdf/source/20200306/C422600_1E6D84923E4A46A82E41ADD87F860B5C.pdf; Supplier: LCSC; Type: 厚膜电阻; Tolerance: ±1%; Power(Watts): 125mW; Overload Voltage (Max): 150V; Temperature Coefficient: ±100ppm/℃; Operating Temperature Range: -55℃~+155℃
R13 R16 = FRC0603F4533TS: 电阻类型:厚膜电阻;阻值:453kΩ;精度:±1%;功率:100mW;工作电压:75V;温度系数:±100ppm/℃;; LCSC Part Name: 453kΩ ±1% 100mW 厚膜电阻; Supplier Part: C3013202; Manufacturer: FOJAN(富捷); Supplier Footprint: 0603; JLCPCB Part Class: Extended Part; Supplier: LCSC; Type: 厚膜电阻; Tolerance: ±1%; Power(Watts): 100mW; Voltage-Supply(Max): 75V; Temperature Coefficient: ±100ppm/℃; Operating Temperature: -55℃~+155℃
R19 = TC0525B8201T5G: 电阻类型:薄膜电阻;阻值:8.2kΩ;精度:±0.1%;功率:125mW;工作电压:150V;温度系数:±25ppm/℃;; LCSC Part Name: 薄膜电阻 8.2kΩ ±0.1%; Supplier Part: C21571500; Manufacturer: UNI-ROYAL(厚声); Supplier Footprint: 0805; JLCPCB Part Class: Extended Part; Datasheet: https://item.szlcsc.com/datasheet/TC0525B8201T5G/22998161.html; Supplier: LCSC; Type: 薄膜电阻; Tolerance: ±0.1%; Power(Watts): 125mW; Voltage-Supply(Max): 150V; Temperature Coefficient: ±25ppm/℃; Operating Temperature: -55℃~+155℃
R20 = FRC0603F2202TS: 电阻类型:厚膜电阻;阻值:22kΩ;精度:±1%;功率:100mW;工作电压:75V;温度系数:±100ppm/℃;; LCSC Part Name: 22kΩ ±1% 100mW 厚膜电阻; Supplier Part: C2907015; Manufacturer: FOJAN(富捷); Supplier Footprint: 0603; JLCPCB Part Class: Extended Part; Supplier: LCSC; Type: 厚膜电阻; Tolerance: ±1%; Power(Watts): 100mW; Voltage-Supply(Max): 75V; Temperature Coefficient: ±100ppm/℃; Operating Temperature: -55℃~+155℃
R21 R27 R33 R34 = 0603WAF0000T5E: 电阻类型:厚膜电阻;阻值:0Ω;精度:±1%;功率:100mW;工作电压:75V;温度系数:-;; LCSC Part Name: 0Ω ±1% 100mW 厚膜电阻; Supplier Part: C21189; Manufacturer: UNI-ROYAL(厚声); Supplier Footprint: 0603; JLCPCB Part Class: Basic Part; Datasheet: https://item.szlcsc.com/datasheet/0603WAF0000T5E/21903.html; Supplier: LCSC; Type: 厚膜电阻; Tolerance: ±1%; Power(Watts): 100mW; Voltage-Supply(Max): 75V; Operating Temperature: -55℃~+155℃
R22 = FRC0805F2213TS: 电阻类型:厚膜电阻;阻值:221kΩ;精度:±1%;功率:125mW;工作电压:150V;温度系数:±100ppm/℃;; LCSC Part Name: 221kΩ ±1% 125mW 厚膜电阻; Supplier Part: C5713300; Manufacturer: FOJAN(富捷); Supplier Footprint: 0805; JLCPCB Part Class: Extended Part; Supplier: LCSC; Type: 厚膜电阻; Tolerance: ±1%; Power(Watts): 125mW; Voltage-Supply(Max): 150V; Temperature Coefficient: ±100ppm/℃; Operating Temperature: -55℃~+155℃
R23 R24 = 0805W8F100JT5E: 电阻类型:厚膜电阻;阻值:10Ω;精度:±1%;功率:125mW;工作电压:150V;温度系数:±200ppm/℃;; LCSC Part Name: 10Ω ±1% 125mW 厚膜电阻; Supplier Part: C17415; Manufacturer: UNI-ROYAL(厚声); Supplier Footprint: 0805; JLCPCB Part Class: Basic Part; Datasheet: https://item.szlcsc.com/datasheet/0805W8F100JT5E/18103.html; Supplier: LCSC; Type: 厚膜电阻; Tolerance: ±1%; Power(Watts): 125mW; Voltage-Supply(Max): 150V; Temperature Coefficient: ±200ppm/℃; Operating Temperature: -55℃~+155℃
R29 = 0603WAF4992T5E: 电阻类型:厚膜电阻;阻值:49.9kΩ;精度:±1%;功率:100mW;工作电压:75V;温度系数:±100ppm/℃;; LCSC Part Name: 49.9kΩ ±1% 100mW 厚膜电阻; Supplier Part: C23184; Manufacturer: UNI-ROYAL(厚声); Supplier Footprint: 0603; JLCPCB Part Class: Basic Part; Datasheet: https://item.szlcsc.com/datasheet/0603WAF4992T5E/23911.html; Supplier: LCSC; Tolerance: ±1%; Power(Watts): 100mW; Overload Voltage (Max): 75V; Temperature Coefficient: ±100ppm/℃; Type: 厚膜电阻; Operating Temperature Range: -55℃~+155℃; Voltage-Supply(Max): 75V; Operating Temperature: -55℃~+155℃
R30 = RT0603BRD07240KL: 电阻类型:薄膜电阻;阻值:240kΩ;精度:±0.1%;功率:100mW;工作电压:75V;温度系数:±25ppm/℃;; LCSC Part Name: 薄膜电阻 240kΩ ±0.1% 100mW; Supplier Part: C515423; Manufacturer: YAGEO(国巨); Supplier Footprint: 0603; JLCPCB Part Class: Extended Part; Datasheet: https://item.szlcsc.com/datasheet/RT0603BRD07240KL/531118.html; Supplier: LCSC; Type: 薄膜电阻; Tolerance: ±0.1%; Power(Watts): 100mW; Voltage-Supply(Max): 75V; Temperature Coefficient: ±25ppm/℃; Operating Temperature: -55℃~+155℃
R35 R44 R50 R54 R64-R66 = FRC0603F22R0TS: 电阻类型:厚膜电阻;阻值:22Ω;精度:±1%;功率:100mW;工作电压:75V;温度系数:±100ppm/℃;; LCSC Part Name: 22Ω ±1% 100mW 厚膜电阻; Supplier Part: C2930077; Manufacturer: FOJAN(富捷); Supplier Footprint: 0603; JLCPCB Part Class: Extended Part; Supplier: LCSC; Type: 厚膜电阻; Tolerance: ±1%; Power(Watts): 100mW; Voltage-Supply(Max): 75V; Temperature Coefficient: ±100ppm/℃; Operating Temperature: -55℃~+155℃
R36 = 0805W8F6202T5E: 电阻类型:厚膜电阻;阻值:62kΩ;精度:±1%;功率:125mW;工作电压:150V;温度系数:±100ppm/℃;; LCSC Part Name: 62kΩ ±1% 125mW 厚膜电阻; Supplier Part: C17783; Manufacturer: UNI-ROYAL(厚声); Supplier Footprint: 0805; JLCPCB Part Class: Extended Part; Datasheet: https://item.szlcsc.com/datasheet/0805W8F6202T5E/18471.html; Supplier: LCSC; Type: 厚膜电阻; Tolerance: ±1%; Power(Watts): 125mW; Voltage-Supply(Max): 150V; Temperature Coefficient: ±100ppm/℃; Operating Temperature: -55℃~+155℃
R37 = FRC2512J102 TS: 电阻类型:厚膜电阻;阻值:1kΩ;精度:±5%;功率:1W;工作电压:200V;温度系数:±100ppm/℃;; LCSC Part Name: 1kΩ ±5% 1W 厚膜电阻; Supplier Part: C2960674; Manufacturer: FOJAN(富捷); Supplier Footprint: 2512; JLCPCB Part Class: Extended Part; Supplier: LCSC; Type: 厚膜电阻; Tolerance: ±5%; Power(Watts): 1W; Voltage-Supply(Max): 200V; Temperature Coefficient: ±100ppm/℃; Operating Temperature: -55℃~+155℃
R48 R70 R71 = AS101AJ022JT4E: 电阻类型:厚膜电阻;阻值:2.2Ω;精度:±5%;功率:1.5W;工作电压:400V;温度系数:±400ppm/℃;; LCSC Part Name: 2.2Ω ±5% 1.5W 厚膜电阻 抗浪涌厚膜晶片电阻器; Supplier Part: C965979; Manufacturer: UNI-ROYAL(厚声); Supplier Footprint: 2010; JLCPCB Part Class: Extended Part; Datasheet: https://atta.szlcsc.com/upload/public/pdf/source/20200723/C560412_34ABBCC623B52ADD707B94178459E29E.pdf; Supplier: LCSC; Type: 厚膜电阻; Tolerance: ±5%; Power(Watts): 1.5W; Voltage-Supply(Max): 400V; Temperature Coefficient: ±400ppm/℃; Operating Temperature: -55℃~+155℃
R52 = RT0805BRD07150KL: 电阻类型:薄膜电阻;阻值:150kΩ;精度:±0.1%;功率:125mW;工作电压:150V;温度系数:±25ppm/℃;; LCSC Part Name: 薄膜电阻 150kΩ ±0.1% 125mW; Supplier Part: C136927; Manufacturer: YAGEO(国巨); Supplier Footprint: 0805; JLCPCB Part Class: Extended Part; Datasheet: https://item.szlcsc.com/datasheet/RT0805BRD07150KL/148243.html; Supplier: LCSC; Type: 薄膜电阻; Tolerance: ±0.1%; Power(Watts): 125mW; Voltage-Supply(Max): 150V; Temperature Coefficient: ±25ppm/℃; Operating Temperature: -55℃~+155℃
R55 = 0603WAF2200T5E: 电阻类型:厚膜电阻;阻值:220Ω;精度:±1%;功率:100mW;最大工作电压:75V;温度系数:±100ppm/℃;; LCSC Part Name: 220Ω ±1% 100mW 厚膜电阻; Supplier Part: C22962; Manufacturer: UNI-ROYAL(厚声); Supplier Footprint: 0603; JLCPCB Part Class: Basic Part; Datasheet: https://atta.szlcsc.com/upload/public/pdf/source/20200306/C422600_1E6D84923E4A46A82E41ADD87F860B5C.pdf; Supplier: LCSC; Type: 厚膜电阻; Tolerance: ±1%; Power(Watts): 100mW; Overload Voltage (Max): 75V; Temperature Coefficient: ±100ppm/℃; Operating Temperature Range: -55℃~+155℃
R56 = HNTC0603-104F3950FB: 功率:100mW;阻值:100kΩ;电阻精度:±1%;B值精度:±1%;B值(25℃/50℃):3950K;最大稳态电流(25℃):100uA;; LCSC Part Name: 片式NTC热敏电阻; Supplier Part: C49247668; Manufacturer: R+O(宏嘉诚); Supplier Footprint: 0603; JLCPCB Part Class: Extended Part; Datasheet: https://item.szlcsc.com/datasheet/HNTC0603-104F3950FB/51678321.html; Supplier: LCSC; Power(Watts): 100mW; Resistance @ 25℃: 100kΩ; Resistance Tolerance: ±1%; B Constant Tolerance: ±1%; B Constant (25℃/50℃): 3950K; Steady State Current (Max): 100uA; Dissipation Factor: 1mW/℃; Thermal Time Constant: 5s; Operating Temperature: -40℃~+125℃; Length: 1.6mm; Width: 0.8mm; Height: 0.8mm; Pitch: 0.3mm
R57 = TD03G4301BT: 电阻类型:薄膜电阻;阻值:4.3kΩ;精度:±0.1%;功率:100mW;工作电压:50V;温度系数:±25ppm/℃;; LCSC Part Name: 薄膜电阻 4.3kΩ ±0.1% 100mW; Supplier Part: C666992; Manufacturer: FH(风华); Supplier Footprint: 0603; JLCPCB Part Class: Extended Part; Datasheet: https://item.szlcsc.com/datasheet/TD03G4301BT/696292.html; Supplier: LCSC; Type: 薄膜电阻; Tolerance: ±0.1%; Power(Watts): 100mW; Voltage-Supply(Max): 50V; Temperature Coefficient: ±25ppm/℃; Operating Temperature: -55℃~+155℃
U1 = LT3763EFE#PBF: 类型:DC-DC控制器;工作电压(DC):6V~60V;开关频率:200kHz~1MHz;通道数:1;输出电压:55V;输出电流:20A;调光:PWM;拓扑结构:降压;; LCSC Part Name: 60V 高电流降压型 LED 驱动器控制器; Supplier Part: C459912; Manufacturer: ADI(亚德诺); Supplier Footprint: TSSOP-28-EP; JLCPCB Part Class: Extended Part; Datasheet: https://item.szlcsc.com/datasheet/LT3763EFE%2523PBF/464238.html; Supplier: LCSC; Type: DC-DC控制器; Voltage - Input(DC): 6V~60V; Frequency - Switching: 200kHz~1MHz; Number of Channels: 1; Output Voltage: 55V; Output Current: 20A; Dimming: PWM; Topology: 降压; Operating temperature: -40℃~+125℃
U2 = STM32G431RBT6: Supplier Part: C431633; Manufacturer: ST(意法半导体); Supplier Footprint: LQFP-64(10x10); JLCPCB Part Class: ExtendedPart; Datasheet: https://atta.szlcsc.com/upload/public/pdf/source/20190925/C431633_8068E60CC825A086DCCD86A4BDED9458.pdf; Supplier: LCSC; Check: true
U3 = XC6210B332MR_C424705: 输出类型:固定;工作电压:6V;输出电压:3.3V;输出电流:900mA;电源纹波抑制比(PSRR):60dB@(1kHz);输出极性:正极;; LCSC Part Name: 3.3V 900mA 6V; Supplier Part: C424705; Manufacturer: TOREX(特瑞仕); Supplier Footprint: SOT-25; JLCPCB Part Class: Extended Part; Datasheet: https://item.szlcsc.com/datasheet/XC6210B332MR/418424.html; Supplier: LCSC; Output Type: 固定; Output Polarity: 正; Number of Outputs: 1; Maximum Input Voltage: 6V; Output Voltage: 3.3V; Dropout Voltage: 75mV@(100mA); Output Current: 900mA; Power Supply Rejection Ratio (PSRR): 60dB@(1kHz); Voltage - Supply: 6V; Voltage Dropout: 75mV@(100mA); standby current: 35uA; Features: 过流保护；过热保护; Operating Temperature: -40℃~+85℃@(Ta); Output Configuration: 正极
U4 = LP5907QMFX-3.3Q1: 输出类型:固定;输出极性:正;最大输入电压:5.5V;输出电压:3.3V;输出电流:250mA;电源纹波抑制比(PSRR):90dB;; Supplier Part: C130005; Manufacturer: TI(德州仪器); Supplier Footprint: SOT-23-5; JLCPCB Part Class: Extended Part; Datasheet: https://atta.szlcsc.com/upload/public/pdf/source/20170918/C130005_1505703244961975089.pdf; Supplier: LCSC; Output Type: 固定; Output Polarity: 正; Number of Outputs: 1; Maximum Input Voltage: 5.5V; Output Voltage: 3.3V; Dropout Voltage: 250mV@(250mA); Output Current: 250mA; Power Supply Rejection Ratio (PSRR): 90dB; Power Supply Rejection Ratio (PRSS): 90dB@(100Hz),60dB@(100kHz); Check: true
U5 = JW5026: 功能类型:降压型;工作电压:4.7V~40V;输出电压:800mV~37V;输出电流:1A;输出类型:可调;; LCSC Part Name: 40V/1A 1.1MHz 同步降压转换器; Supplier Part: C185109; Manufacturer: Joulwatt(杰华特); Supplier Footprint: SOT-23-6; JLCPCB Part Class: Extended Part; Datasheet: https://item.szlcsc.com/datasheet/JW5026/196514.html; Supplier: LCSC; Function: 降压型; Voltage - Supply: 4.7V~40V; Output Voltage: 800mV~37V; Output Current: 1A; Frequency - Switching: 750kHz~1.25MHz; Operating Temperature: -40℃~+125℃@(TJ); Synchronous Rectifier: 是; Number of Outputs: 1; Topology: 降压式; Quiescent Current: 40uA; Switch tube (built-in/external): 内置; Output Type: 可调
U6 = LM5164DDAR: 功能类型:降压型;工作电压:6V~100V;输出电压:-;输出电流:1A;输出类型:可调;; LCSC Part Name: 100V 输入、1A 同步降压 DC/DC 转换器; Supplier Part: C477928; Manufacturer: TI(德州仪器); Supplier Footprint: SO-8-EP; JLCPCB Part Class: Extended Part; Datasheet: https://www.ti.com/cn/lit/gpn/lm5164; Supplier: LCSC; Function: 降压型; Synchronous Rectification: 是; Output Type: 可调; Number of Outputs: 1; Topology: 降压式; Input Voltage: 6V~100V; Output Current (Max): 1A; Switching Frequency: 1MHz; Operating Temperature: -40℃~+150℃@(TJ); Voltage - Supply: 6V~100V; Output Current: 1A; Frequency - Switching: 1MHz; Synchronous Rectifier: 是; Quiescent Current: 10.5uA; Switch tube (built-in/external): 内置
U7 = BZT52C43_C22395571: 二极管配置:独立式;稳压值(标称值):43V;稳压值(范围):40.85V~45.15V;耗散功率(Pd):350mW;; LCSC Part Name: 表面贴装齐纳二极管; Supplier Part: C22395571; Manufacturer: R+O(宏嘉诚); Supplier Footprint: SOD-123; JLCPCB Part Class: Extended Part; Datasheet: https://item.szlcsc.com/datasheet/BZT52C43/23994568.html; Supplier: LCSC; Diode Configuration: 独立式; Zener Voltage(Nom): 43V; Reverse Leakage Current (Ir): 100nA@32V; Zener Voltage(Range): 40.85V~45.15V; Pd - Power Dissipation: 350mW; Impedance(Zzt): 100Ω; Impedance(Zzk): 700Ω; Operating Junction Temperature Range: -55℃~+150℃
U8 = TLP2761(D4-TP4,E: 输入类型:DC;工作电压:2.7V~5.5V;CMTI(kV/us):20kV/us;传输速率:15Mbps;; LCSC Part Name: TLP2761(D4-TP4,E(T; Supplier Part: C24267845; Manufacturer: TOSHIBA(东芝); Supplier Footprint: SO-6L; Datasheet: https://item.szlcsc.com/datasheet/TLP2761(D4-TP4%252CE/25997706.html; Supplier: LCSC; Input Type: DC; Voltage - Supply: 2.7V~5.5V; Isolation Voltage(Vrms): 5kV; CMTI(kV/us): 20kV/us; Data Rate: 15Mbps; Number of Channels: 1; Operating Temperature: -40℃~+125℃; Low level Delay Time: 80ns; High level Delay Time: 80ns; Input threshold current: 1.6mA; Output current: 10mA; power dissipation: 20mW; Voltage - Forward(Vf): 1.5V; Reverse Voltage: 5V; Forward Current(If): 10mA
U9 = DB301V-3.5-2P-GN-S: 结构:1x2P;间距:3.5mm;颜色:绿色;安装方式:直插;排数:1;每排PIN数:2;额定电流:7A;额定电压:300V;线规 - AWG:18~24;线规 - 平方毫米:0.5~1;工作温度:-40℃~+105℃;; LCSC Part Name: 1x2P 3.5mm 直插 排数:1 每排P数:2; Supplier Part: C695629; Manufacturer: DORABO(地博电气); Supplier Footprint: 插件,P=3.5mm; JLCPCB Part Class: Extended Part; Datasheet: https://item.szlcsc.com/datasheet/DB301V-3.5-2P-GN-S/728965.html; Supplier: LCSC; Number of Positions or Pins: 1x2P; Pitch: 3.5mm; Color: 绿色; Mounting Type: 直插; Number of Pins: 2P; Number of Rows: 1; Number of PINs Per Row: 2; Screw Specification: M2; Current Rating: 7A; Voltage Rating (Max): 300V; Wire Gauge - AWG: 18~24; Wire Gauge - mm2: 0.5~1; Operating Temperature: -40℃~+105℃
X1 = X32258MSB4SI: 频率:8MHz;负载电容:20pF;频率公差:±10ppm;; LCSC Part Name: 8MHz ±10ppm 20pF YSX321SL; Supplier Part: C2682774; Manufacturer: YXC(扬兴晶振); Supplier Footprint: SMD3225-4P; JLCPCB Part Class: Extended Part; Datasheet: https://atta.szlcsc.com/upload/public/pdf/source/20210106/C2682774_0CD4FDA5D9DA3FBEEC23BD607A48E4B0.pdf; Supplier: LCSC; Crystal Type: 贴片无源晶振; Load Capacitance: 20pF; Frequency Tolerance: ±10ppm; Frequency Stability: ±30ppm; Operating Temperature: -40℃~+85℃; Check: true

## Nets
5V: C1.1 C30.1 C65.1 CN7.1 LED1.3(VDD) R26.1 R27.2 U3.1(VIN) U3.3(CE) U4.1(IN) U4.3(EN)
12V: C22.2 C26.2 C27.1 C28.1 C29.1 C37.2 C38.1 C39.2 C66.1 C67.1 C68.1 CN10.2 CN11.1 L2.2 R16.2 R25.1 R38.1 U5.5(VIN)
AGND: C2.2 C41.1 C42.2 C48.2 C50.2 C54.1 C58.1 C60.1 C72.1 C78.1 R19.2 R21.2 R22.1 R41.2 R49.2 R56.2 U1.12(GND) U2.27(VSSA)
AVCC: C48.1 C50.1 CN4.1 U2.28(VREF+) U2.29(VDDA) U4.5(OUT)
GND: C1.2 C6.1 C9.2 C10.1 C11.1 C12.1 C13.1 C14.1 C15.1 C16.1 C17.2 C18.2 C19.1 C20.1 C23.2 C24.2 C26.1 C27.2 C28.2 C29.2 C30.2 C31.2 C32.2 C33.2 C34.2 C35.2 C36.1 C37.1 C38.2 C39.1 C43.1 C44.2 C45.2 C46.2 C47.1 C51.2 C52.1 C55.2 C56.2 C57.2 C59.2 C61.2 C62.2 C63.1 C64.1 C65.2 C66.2 C67.2 C68.2 C69.1 C75.2 C80.1 C81.1 C82.1 C83.1 C106.2 CN1.1(-) CN6.1 CN9.7 CN9.8 CN9.9 CN10.1 CN10.3 CN10.4 D1.1 D2.1 D3.1 D4.1 D5.2(A) D7.2(A) D10.2(A) D11.1 K1.1 K2.1 L1.2 L3.2 L4.2 L5.2 L10.2 LED1.1(GND) Q3.1(S) Q3.2(S) Q3.3(S) Q4.1(S) Q4.2(S) Q4.3(S) R10.1 R21.1 R28.1 R29.1 R32.2 R33.1 R33.2 R34.1 R34.2 R37.1 R39.2 R53.2 R61.1 U1.21(SYNC) U1.23(GND) U1.28(GND) U1.29(GND) U2.15(VSS) U2.31(VSS) U2.47(VSS) U2.63(VSS) U3.2(VSS) U4.2(GND) U5.2(GND) U6.1(GND) U6.9(EP) U8.4(GND) X1.2(GND) X1.4(GND)
GND_BAT: C3.1 C4.1 C5.2 CN2.1(-) D6.1 Q4.5(D) U7.2(A)
VCC: C31.1 C32.1 C33.1 C55.1 C56.1 C57.1 C62.1 CN5.1 CN9.1 R3.2 R14.2 R31.1 R67.1 U2.1(VBAT) U2.16(VDD) U2.32(VDD) U2.48(VDD) U2.64(VDD) U3.5(VOUT) U8.6(VDD)
VCC_BAT: C3.2 C4.2 C8.2 CN2.2(+) CN3.1 D6.2 D8.1(K) Q11.2(E) Q12.3(S) R6.2 R7.2 R8.2
VCC_OUT: C59.1 C63.2 C64.2 CN1.2(+) CN14.1 D10.1(K) R1.2 R24.2 R30.2 R37.2
CLK: R65.1 U2.50(PA14)
DCBUS: C10.2 C11.2 C12.2 C13.2 C14.2 C15.2 C16.2 C17.1 C18.1 C19.2 C20.2 C23.1 C24.1 C36.2 C43.2 CN8.1 Q12.4(D) R12.1 R15.2 R17.2 R20.1 R52.2 R60.2 U6.2(VIN)
DIANLIUKONGZHI: C41.2 CN13.1 R2.2 R19.1 U1.14(CTRL1)
DIO: R66.1 U2.49(PA13)
FB: C25.2 R16.1 R29.2 U6.5(FB)
KEY1: C61.1 K2.2 R67.2 U2.41(PC9)
NRST: C51.1 K1.2 R31.2 R44.1 U2.7(PG10-NRST)
O_IN: C34.1 U2.5(PF0-OSC_IN) X1.1
O_OUT: C35.1 U2.6(PF1-OSC_OUT) X1.3
PA: D13.1(C) R18.1 U9.1
PWM: R35.2 R40.1
R_EN: R45.1 U2.2(PC13)
RGB: LED1.2(DI) U2.19(PA5)
RX_TX: R50.1 U2.33(PB11)
SHOOT: R55.2 U8.5(VO(Output))
SHUCHUDIANLIUJIANCE: C58.2 R63.1 U2.36(PB14)
SHURUDIANLIUJIANCE: C78.2 R62.1 U2.37(PB15)
STOP: CN18.1 R3.1 R54.2 U1.9(FAULT#)
TX_RX: R64.1 U2.30(PB10)
WGND: D13.2(A) U8.3(Cathode) U9.2
$1N490: C7.1 Q11.3(C) R10.2 R11.2
$1N491: C8.1 D8.2(A) Q12.1(G) R11.1
$1N492: C7.2 Q11.1(B) R9.1
$1N493: R8.1 R9.2 U7.1(K)
$1N496: C6.2 D7.1(K) Q4.4(G) R7.1
$1N497: C5.1 R6.1
$1N498: C9.1 R17.1
$1N520: L1.1 R20.2
$1N560: C21.2 U6.7(BST)
$1N561: R15.1 U6.3(EN)
$1N562: C21.1 L2.1 R13.2 U6.8(SW)
$1N567: R28.2 U6.4(RON)
$1N570: L4.1 R25.2
$1N628: L3.1 R14.1
$1N635: C40.1 U5.1(BST)
$1N636: C40.2 L7.1 U5.6(SW)
$1N647: L5.1 R26.2
$1N701: L10.1 R45.2
$1N731: CN9.5 D4.2 R50.2
$1N732: CN9.4 D3.2 R64.2
$1N733: CN9.3 D1.2 R65.2
$1N734: CN9.2 D2.2 R66.2
$1N758: R35.1 U2.43(PA9)
$1N824: R55.1 U2.42(PA8)
$1N834: R36.2 R39.1 U5.3(FB)
$1N836: C44.1 C45.1 C46.1 C106.1 L7.2 R27.1 R36.1
$1N839: R38.2 U5.4(EN)
$1N846: C22.1 C25.1 R13.1
$1N868: CN9.6 D11.2 R44.2
$1N887: R61.2 U2.61(PB8-BOOT0)
$1N947: C47.2 C80.2 C81.2 C82.2 C83.2 Q1.5(D) Q1.6(D) Q1.7(D) Q1.8(D) Q1.9(D) R12.2 R59.2 U1.3(VIN)
$1N960: CN17.1 R62.2 U1.8(IVINMON)
$1N961: CN12.1 R63.2 U1.19(ISMON)
$1N963: C75.1 CN15.1 D9.2(A) U1.2(INTVCC)
$1N964: C76.1 D9.1(K) U1.27(BOOST)
$1N965: C54.2 R56.1 R57.2 U1.13(CTRL2)
$1N967: C2.1 CN16.1 R57.1 U1.5(VREF) U1.10(FBIN)
$1N969: C72.2 U1.15(SS)
$1N970: C52.2 R52.1 R53.1 U1.4(EN/UVLO)
$1N971: R4.1 U1.18(VC)
$1N973: C42.1 R4.2
$1N978: R30.1 R49.1 U1.11(FB)
$1N979: C49.2 R23.1 U1.17(SENSE+)
$1N980: C49.1 R24.1 U1.16(SENSE–)
$1N981: R22.2 U1.20(RT)
$1N983: C77.2 R59.1 U1.6(IVINN)
$1N984: L6.2 R1.1 R23.2
$1N986: C77.1 R60.1 U1.7(IVINP)
$1N987: D12.2(A) Q3.4(G) R32.1 R71.1
$1N988: D12.1(C) R71.2 U1.1(BG)
$1N989: C69.2 R48.1
$1N990: C76.2 D5.1(K) L6.1 Q1.1(S) Q1.2(S) Q1.3(S) Q3.5(D) Q3.6(D) Q3.7(D) Q3.8(D) Q3.9(D) R5.1 R48.2 U1.26(SW)
$1N991: Q1.4(G) R5.2 R70.1
$1N992: R70.2 U1.25(TG)
$1N1002: C60.2 R40.2 R41.1 U1.22(PWM)
$1N1004: R54.1 U2.34(PB12)
$1N1013: R2.1 U2.18(PA4)
$1N1014: R18.2 U8.1(Anode)

Not connected (* = marked no-connect by the designer): CN1 3* 4*; CN2 3 4; L6 3(NC)*; LED1 4(DO)*; U1 24(PWM_OUT)*; U2 3(PC14-OSC32_IN) 4(PC15-OSC32_OUT) 8(PC0) 9(PC1) 10(PC2) 11(PC3) 12(PA0) 13(PA1) 14(PA2) 17(PA3) 20(PA6) 21(PA7) 22(PC4) 23(PC5) 24(PB0) 25(PB1) 26(PB2) 35(PB13) 38(PC6) 39(PC7) 40(PC8) 44(PA10) 45(PA11) 46(PA12) 51(PA15) 52(PC10) 53(PC11) 54(PC12) 55(PD2) 56(PB3) 57(PB4) 58(PB5) 59(PB6) 60(PB7) 62(PB9); U3 4(NC); U4 4(NC); U6 6(PG); U8 2(N.C.)

## Notes on the sheet
- 防反接&防过压&缓启动
- 36V输入
- 恒流源
- 200kHz
- S
- D
- G
- UVLO（欠压锁定）阈值 24.3V
- SENSE+ 和 SENSE- 引脚的线需要尽可能靠近
- MCU
- VBUS---12V
- 5V---3.3V
- 去耦电容
- 开启 DAC Buffer
- VFB = 1.2V
- R20 = (VFB * R16) / (VOUT - VFB)
- 8M晶振
- STOP
  一、 STM32CubeMX 的严格配置指南
  对于网表中的 STOP 信号，接到的是单片机的 PB12。在 CubeMX 中只做以下设置：
  引脚复用配置：
  在 Pinout 视图找到 PB12，左键点击，选择 GPIO_EXTI12（绝对不要选 TIM1_BKIN）。
  GPIO 参数设置（System Core -> GPIO）：
  GPIO mode: 选择 External Interrupt Mode with Falling edge trigger detection（仅下降沿触发）。
  GPIO Pull-up/Pull-down: 选择 No pull-up and no pull-down（**非常重要！**你的硬件上已经有 R3 10kΩ 上拉到 3.3V 了，单片机内部绝不能再开上拉或下拉，避免阻抗干扰）。
  中断优先级设置（System Core -> NVIC）：
  勾选 EXTI line[15:10] interrupts 的 Enable。
  把它的抢占优先级设置得高一点（比如设为 1 或 2，确保故障响应比串口通信等普通任务快）。
  配置一个硬件定时器（System Core -> Timers）：
  随便开一个基本定时器（比如 TIM6），分频配置为 1ms 进一次中断，作为系统的“非阻塞延时时基”。
  二、 软件状态机逻辑总结（不阻塞 CPU 版本）
  核心思想：待机不查、启动盲等、超时复核、触发消抖。
  阶段 1：激光器待机状态（PWM = 0）
  动作：关闭 PB12 的 EXTI 中断。因为此时 Vout 为 0，LT3763 必然输出低电平报警，直接无视它。
  阶段 2：激光器启动（打出 PWM 的瞬间）
  动作：发送 PWM -> 启动 10ms 的定时器（不去碰 EXTI）。
  逻辑：给硬件 10ms 的时间去把电压建立起来，跨过 0.25V 的“假短路”红线。
  阶段 3：10ms 启动期结束（在定时器中断里执行）
  动作：立刻用 HAL_GPIO_ReadPin 读取 PB12。
  逻辑：
  如果读到是 低电平(0)：说明是真故障（真短路了）！立刻执行物理锁死关机。
  如果读到是 高电平(1)：说明系统已越过危险区进入稳态。此时清除一下 EXTI 的挂起标志位（__HAL_GPIO_EXTI_CLEAR_IT），然后开启 PB12 的 EXTI 中断，进入“巡逻模式”。
  阶段 4：稳态运行中突发故障（在 EXTI12 中断回调里执行）
  动作：PB12 发生下降沿进入中断 -> 立刻关闭/屏蔽 PB12 的 EXTI 中断 -> 启动 5ms 定时器 -> 退出中断。
  逻辑：屏蔽自己是为了防止高频毛刺疯狂触发中断打死 CPU。用 5ms 定时器做“异步消抖”。
  阶段 5：5ms 消抖确认（在定时器中断里执行）
  动作：读取 PB12。
  逻辑：
  如果依然是 低电平(0)：实锤是设备故障，立刻执行物理锁死关机、停 DAC/PWM、报错。
  如果是 高电平(1)：说明刚才触发中断的只是一个 EMI 强干扰毛刺，虚惊一场。清除中断标志位，重新开启 PB12 的 EXTI 中断，继续巡逻。
- key_reset
- 风扇
- 电源滤波
- 12V---5V
- LED
- RGB
- SWD+USART
- 5V---3.3V
- VFB = 0.8V
- 单独给ADC基准供电
- 指示灯
- VOUT = VFB * (R36 + R39) / R39
